# EAGLE schematic vONE-UNO (EAGLE 9.6.2)
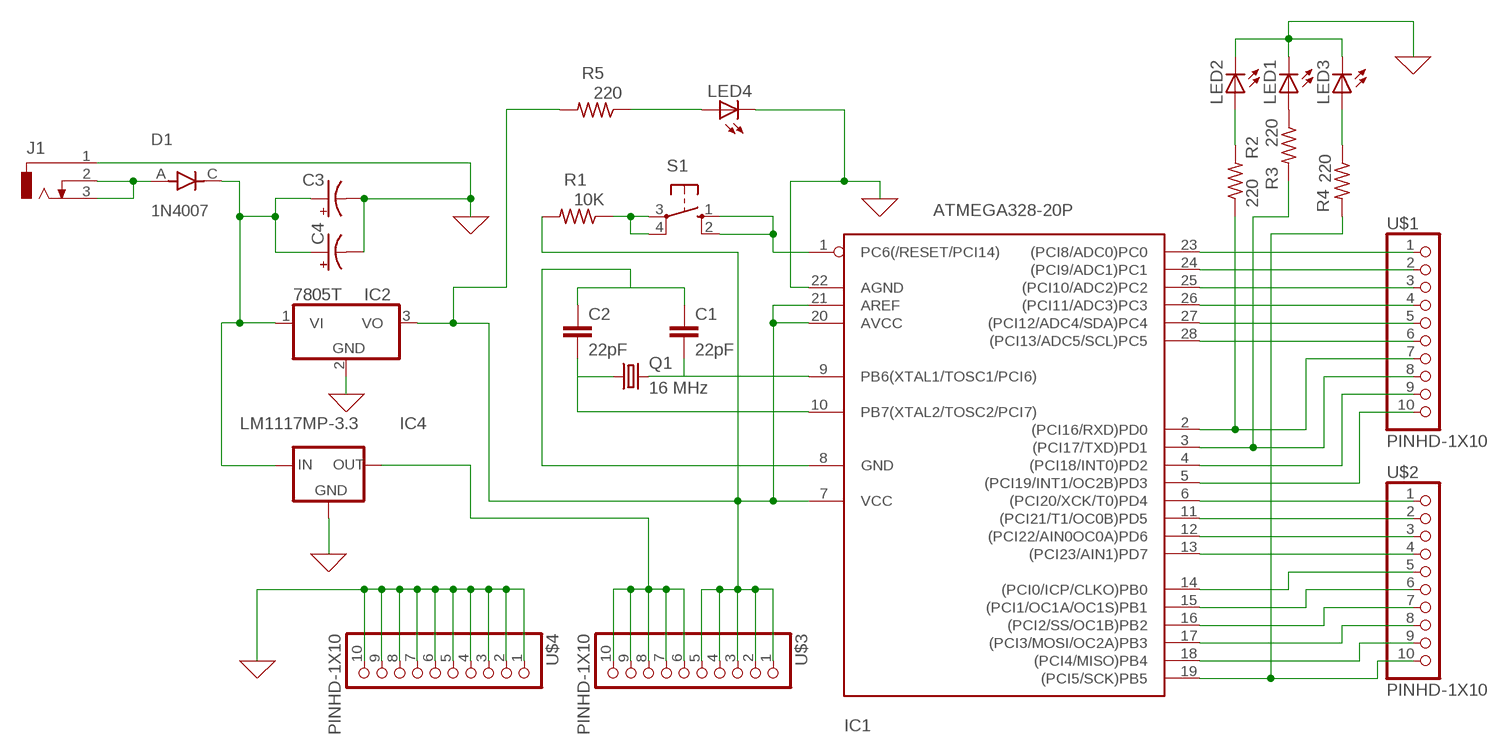
[diagram p0: schematic, sheet 1]

## Parts
C1  22pF  C2,5-3  [C2.5-3]
C2  22pF  C2,5-3  [C2.5-3]
C3  CPOL-USE2,5-6E  [E2,5-6E]
C4  CPOL-USE2,5-6E  [E2,5-6E]
D1  1N4007  [DIOAD1060W80L520D270]
IC1  ATMEGA328-20P  [DIL28-3]
IC2  7805T  [TO220H]
IC4  LM1117MP-3.3  [SOT223]
J1  DCJ0303  [DCJ0303]
LED1  LED5MM  [LED5MM]
LED2  LED5MM  [LED5MM]
LED3  LED5MM  [LED5MM]
LED4  LED5MM  [LED5MM]
Q1  16 MHz  CRYSTALHC49S  [HC49/S]
R1  10K  FLIPFLOP-RES  [0805-THM]
R2  220  FLIPFLOP-RES  [0805-THM]
R3  220  FLIPFLOP-RES  [0805-THM]
R4  220  FLIPFLOP-RES  [0805-THM]
R5  220  FLIPFLOP-RES  [0805-THM]
S1  10-XX  [B3F-10XX]
U$1  PINHD-1X10  [1X10-BIG]
U$2  PINHD-1X10  [1X10-BIG]
U$3  PINHD-1X10  [1X10-BIG]
U$4  PINHD-1X10  [1X10-BIG]

## Nets
0: C3.- C4.- IC1.22(AGND) IC2.2(GND) IC4.1(GND) J1.1 LED1.K(C) LED2.K(C) LED3.K(C) LED4.K(C) U$4.1 U$4.2 U$4.3 U$4.4 U$4.5 U$4.6 U$4.7 U$4.8 U$4.9 U$4.10 ; supply symbol labelled GND
N$1: D1.A J1.2 J1.3
N$2: IC1.1(PC6(/RESET/PCI14)) S1.1(S) S1.2(S1)
N$3: C1.1 C2.1 IC1.8(GND)
N$4: IC1.23((PCI8/ADC0)PC0) U$1.1
N$5: IC1.24((PCI9/ADC1)PC1) U$1.2
N$6: IC1.25((PCI10/ADC2)PC2) U$1.3
N$7: IC1.26((PCI11/ADC3)PC3) U$1.4
N$8: IC1.27((PCI12/ADC4/SDA)PC4) U$1.5
N$9: IC1.28((PCI13/ADC5/SCL)PC5) U$1.6
N$10: IC1.2((PCI16/RXD)PD0) R3.1 U$1.7
N$11: R1.1 S1.3(P) S1.4(P1)
N$12: C1.2 IC1.9(PB6(XTAL1/TOSC1/PCI6)) Q1.2
N$13: C2.2 IC1.10(PB7(XTAL2/TOSC2/PCI7)) Q1.1
N$14: IC1.4((PCI18/INT0)PD2) U$1.9
N$15: IC1.5((PCI19/INT1/OC2B)PD3) U$1.10
N$16: IC1.19((PCI5/SCK)PB5) R4.2 U$2.10
N$17: IC1.11((PCI21/T1/OC0B)PD5) U$2.2
N$18: IC1.12((PCI22/AIN0OC0A)PD6) U$2.3
N$19: IC1.13((PCI23/AIN1)PD7) U$2.4
N$20: IC1.14((PCI0/ICP/CLKO)PB0) U$2.5
N$22: IC1.15((PCI1/OC1A/OC1S)PB1) U$2.6
N$23: IC1.16((PCI2/SS/OC1B)PB2) U$2.7
N$24: IC1.17((PCI3/MOSI/OC2A)PB3) U$2.8
N$25: IC1.18((PCI4/MISO)PB4) U$2.9
N$26: LED4.A R5.1
N$28: IC4.2(OUT) IC4.4(OUT) U$3.6 U$3.7 U$3.8 U$3.9 U$3.10
N$29: LED2.A R3.2
N$30: LED1.A R2.1
N$31: LED3.A R4.1
N$32: IC1.7(VCC) IC1.20(AVCC) IC1.21(AREF) IC2.3(VO) R1.2 R5.2 U$3.1 U$3.2 U$3.3 U$3.4 U$3.5
N$34: C3.+ C4.+ D1.C IC2.1(VI) IC4.3(IN)
N$36: IC1.6((PCI20/XCK/T0)PD4) U$2.1
N$37: IC1.3((PCI17/TXD)PD1) R2.2 U$1.8

## Library data of the parts
C1 C2 = capacitor-wima:C: CAPACITOR naming: grid - package width
C3 C4 = adafruit:CPOL-US: POLARIZED CAPACITOR, American symbol
D1 = 1N4007:1N4007: Diode Switching 1KV 1A 2-Pin DO-41; AVAILABILITY: Unavailable; DESCRIPTION: Diode Standard 1000V 1A Through Hole DO-41; MF: ON Semiconductor; MP: 1N4007; PACKAGE: DO-41-2 ON Semiconductor; PRICE: None
IC1 = atmega328:ATMEGA328*P: MICROCONTROLLER 32 kBytes FLASH 2 kBytes SRAM 1 kBytes EEPROM USART 8-channel 10 bit ADC
IC2 = adafruit:78*: Positive VOLTAGE REGULATOR Added bigger pads to the TO-92 package
IC4 = lm1117_10:LM1117?-*: 800mA Low-Dropout Linear Regulator Source: http://www.ti.com/lit/ds/symlink/lm1117-n.pdf; MF: Texas Instruments; MPN: LM1117MP-3.3; OC_FARNELL: 9778195; OC_NEWARK: 28X3416
J1 = con-jack:DCJ0303: DC POWER JACK Source: DCJ0303.pdf; OC_FARNELL: unknown; OC_NEWARK: unknown
LED1-LED4 = adafruit:LED: LED OSRAM: - CHIPLED LG R971, LG N971, LY N971, LG Q971, LY Q971, LO R971, LY R971 LH N974, LH R974 LS Q976, LO Q976, LY Q976 LO Q996 - Hyper CHIPLED LW Q18S LB Q993, LB Q99A, LB R99A - SideLED LS A670, LO A670, LY A670, LG A670, LP A670 LB A673, LV A673, LT A673, LW A673 LH A674 LY A675 LS A676, LA A676, LO A676, LY A676, LW A676 LS A679, LY A679, LG A679 - Hyper Micro SIDELED® LS Y876, LA Y876, LO Y876, LY Y876 LT Y87S - SmartLED LW L88C, LW L88S LB L89C, LB L89S, LG L890 LS L89K, LO L89K, LY L89K LS L896, LA L896, LO L896, LY L896 - TOPLED LS T670, LO T670, LY T670, LG T670, LP T670 LSG T670, LSP T670, LSY T670, LOP T670, LYG T670 LG T671, LOG T671, LSG T671 LB T673, LV T673, LT T673, LW T673 LH T674 LS T676, LA T676, LO T676, LY T676, LB T676, LH T676, LSB T676, LW T676 LB T67C, LV T67C, LT T67C, LS T67K, LO T67K, LY T67K, LW E67C LS E67B, LA E67B, LO E67B, LY E67B, LB E67C, LV E67C, LT E67C LW T67C LS T679, LY T679, LG T679 LS T770, LO T770, LY T770, LG T770, LP T770 LB T773, LV T773, LT T773, LW T773 LH T774 LS E675, LA E675, LY E675, LS T675 LS T776, LA T776, LO T776, LY T776, LB T776 LHGB T686 LT T68C, LB T68C - Hyper Mini TOPLED® LB M676 - Mini TOPLED Santana® LG M470 LS M47K, LO M47K, LY M47K Source: http://www.osram.convergy.de/
Q1 = adafruit:CRYSTAL: CRYSTAL; OC_FARNELL: 1667008; OC_NEWARK: unknown
R1-R5 = adafruit:FLIPFLOP-RES: Flip Flop resistor An 0805 resistor inside a standard 1/4W 5% resistor. Makes for easy mods
S1 = switch-omron:10-XX: OMRON SWITCH; MPN: B3F-1000; OC_FARNELL: 176432; OC_NEWARK: 36M3542
U$1-U$4 = adafruit:PINHD-1X10: Pin header 1x10 0.1" spacing With round pins